# EAGLE design gateInBreakout (EAGLE 9.6.2)
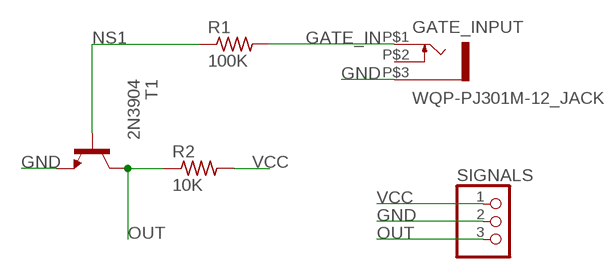
[diagram p0: schematic, sheet 1]

## Parts
GATE_INPUT  WQP-PJ301M-12_JACK  [WQP-PJ301M-12_JACK]
R1  100K  R-US_0207/9  [0207/9]
R2  10K  R-US_0207/9  [0207/9]
SIGNALS  PINHD-1X3  [1X03]
T1  2N3904  [TO92]

## Nets
GATE_IN: GATE_INPUT.P$1 R1.2
GND: GATE_INPUT.P$3 SIGNALS.2 T1.3(E)
NS1: R1.1 T1.2(B)
OUT: R2.1 SIGNALS.3 T1.1(C)
VCC: R2.2 SIGNALS.1
Unconnected: GATE_INPUT.P$2

## Library data of the parts
GATE_INPUT = thonkiconn:WQP-PJ301M-12_JACK
R1 R2 = adafruit:R-US_: RESISTOR, American symbol
SIGNALS = adafruit:PINHD-1X3: PIN HEADER
T1 = transistor:2N3904: NPN TRANSISTOR

## Board
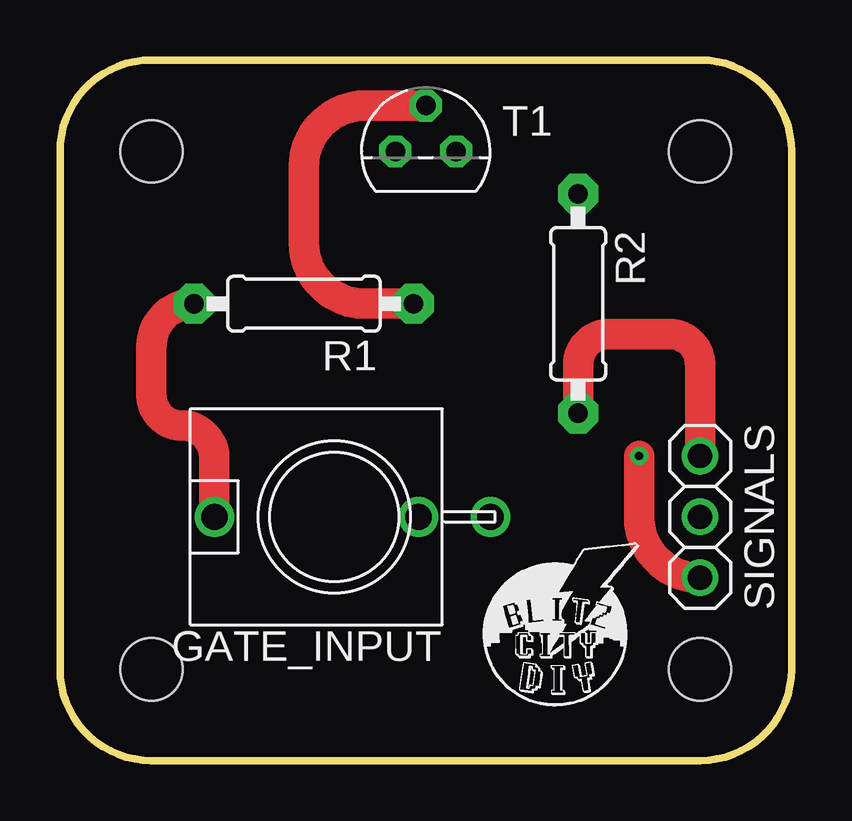
[diagram p1: board, top side]
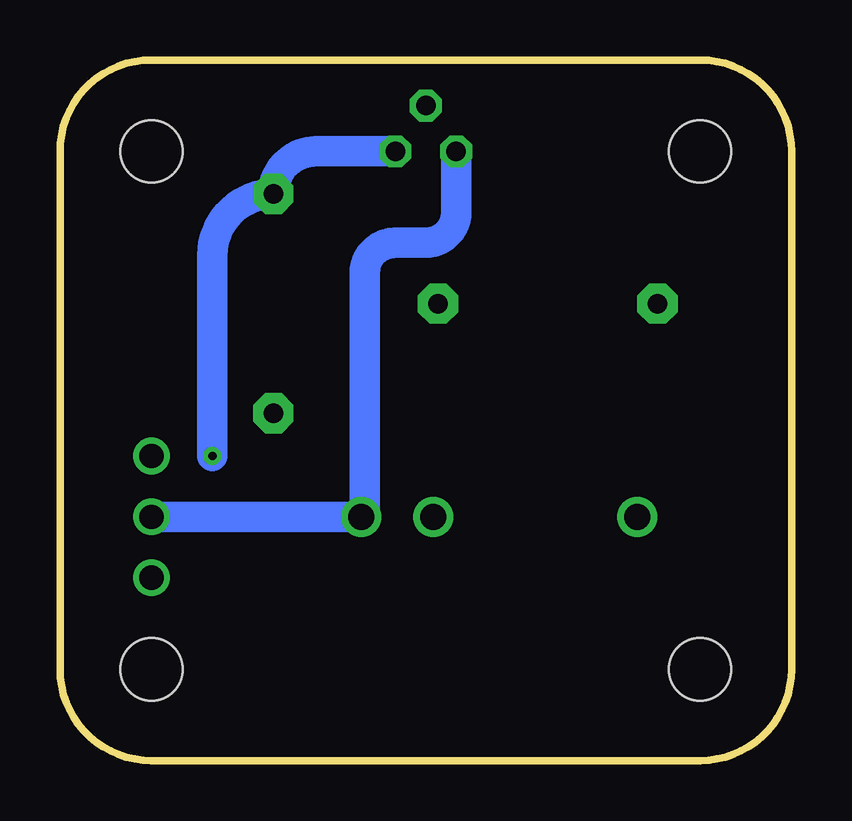
[diagram p2: board, bottom side, seen from below]

Size 30.48 x 29.21 mm. Coordinates in mm from the lower left corner, seen from the top.
Outline: 0,25.4 arc-90 3.81,29.21 26.67,29.21 arc-90 30.48,25.4 30.48,3.81 arc-90 26.67,0 3.81,0 arc-90 0,3.81 0,25.4
Copper layers (1*16): Top 0.035mm / dielectric 1.5mm / Bottom 0.035mm
Design rules "default": minimum track width 6mil, minimum drill 0.35mm, track to track 6mil, track to pad 6mil, pad to pad 6mil, via to via 6mil, smd to smd 6mil, copper to edge 40mil, drill to drill 6mil, minimum pad ring 10mil, minimum via ring 8mil, stop-mask expansion 4mil, vias tented up to drill 0mil, thermal gap 10mil
Holes 2.6 mm at 3.81,25.4 26.67,25.4 26.67,3.81 3.81,3.81

### Footprints (pad centres in the part's own frame; a part is rotated, then mirrored left to right if it is on the bottom)
WQP-PJ301M-12_JACK = drill 1.1: P$1 0,5; P$2 0,-3.5; P$3 0,-6.5
0207/9 = drill 0.813 pad 1.676 octagon: 1 -4.572,0; 2 4.572,0
1X03 = drill 1.016: 1 -2.54,0; 2 0,0; 3 2.54,0
TO92 = drill 0.813 octagon: 1 1.27,0; 2 0,1.905; 3 -1.27,0

### Placement (x,y rotation side)
BLABEL0  [BLABEL0]  21.05,18.87 0 bottom
BLABEL1  [BLABEL1]  11.67,4.21 0 bottom
GATE_INPUT  11.43,10.16 90 top
PLABEL0  [PLABEL0]  28.12,7.08 0 top
PLABEL1  [PLABEL1]  28.37,12.38 0 top
PLABEL2  [PLABEL2]  28.77,9.93 0 top
PLABEL3  [PLABEL3]  9.09,4.23 0 top
PLABEL4  [PLABEL4]  8.89,16.93 0 top
PLABEL5  [PLABEL5]  20.32,17.78 90 top
R1  10.16,19.05 180 top
R2  21.59,19.05 270 top
SIGNALS  26.67,10.16 270 top
T1  15.24,25.4 0 top

### Tracks (layer width: path | path; a pad name or v marks a point on that pad's centre or on a via)
GATE_IN
  Top 1.27: GATE_INPUT.P$1 6.43,12.62 arc90 5.08,13.97 arc-90 3.81,15.24 3.81,16.51 3.81,17.27 arc-90 R1.2
GND
  Bottom 1.27: SIGNALS.2 GATE_INPUT.P$3 arc-90 17.78,10.31 17.78,20.32 arc90 16.51,21.59 15.24,21.59 arc-90 13.97,22.86 T1.3
NS1
  Top 1.27: R1.1 12.7,19.05 arc-90 10.16,21.59 10.16,24.77 arc-90 12.7,27.3 T1.2
OUT  (via drill 0.35)
  Top 1.27: v24.13,12.7 24.13,10.16 arc90 SIGNALS.3
  Bottom 1.27: v24.13,12.7 24.13,21.08 arc90 R2.1 arc90 19.81,25.4 T1.1
VCC
  Top 1.27: SIGNALS.1 26.67,16.51 arc90 25.4,17.78 22.86,17.78 arc90 21.59,16.51 R2.2

### Text on the board
Pinguin_tBackup: 100K | 10K | ⚡ | G | ➡ | GATE IN
Pinguin_bBackup: EURORACK / GATE IN / CIRCUIT | VERSION 0 / December 2022